# Altium project ESP32 with c port.PrjPcb
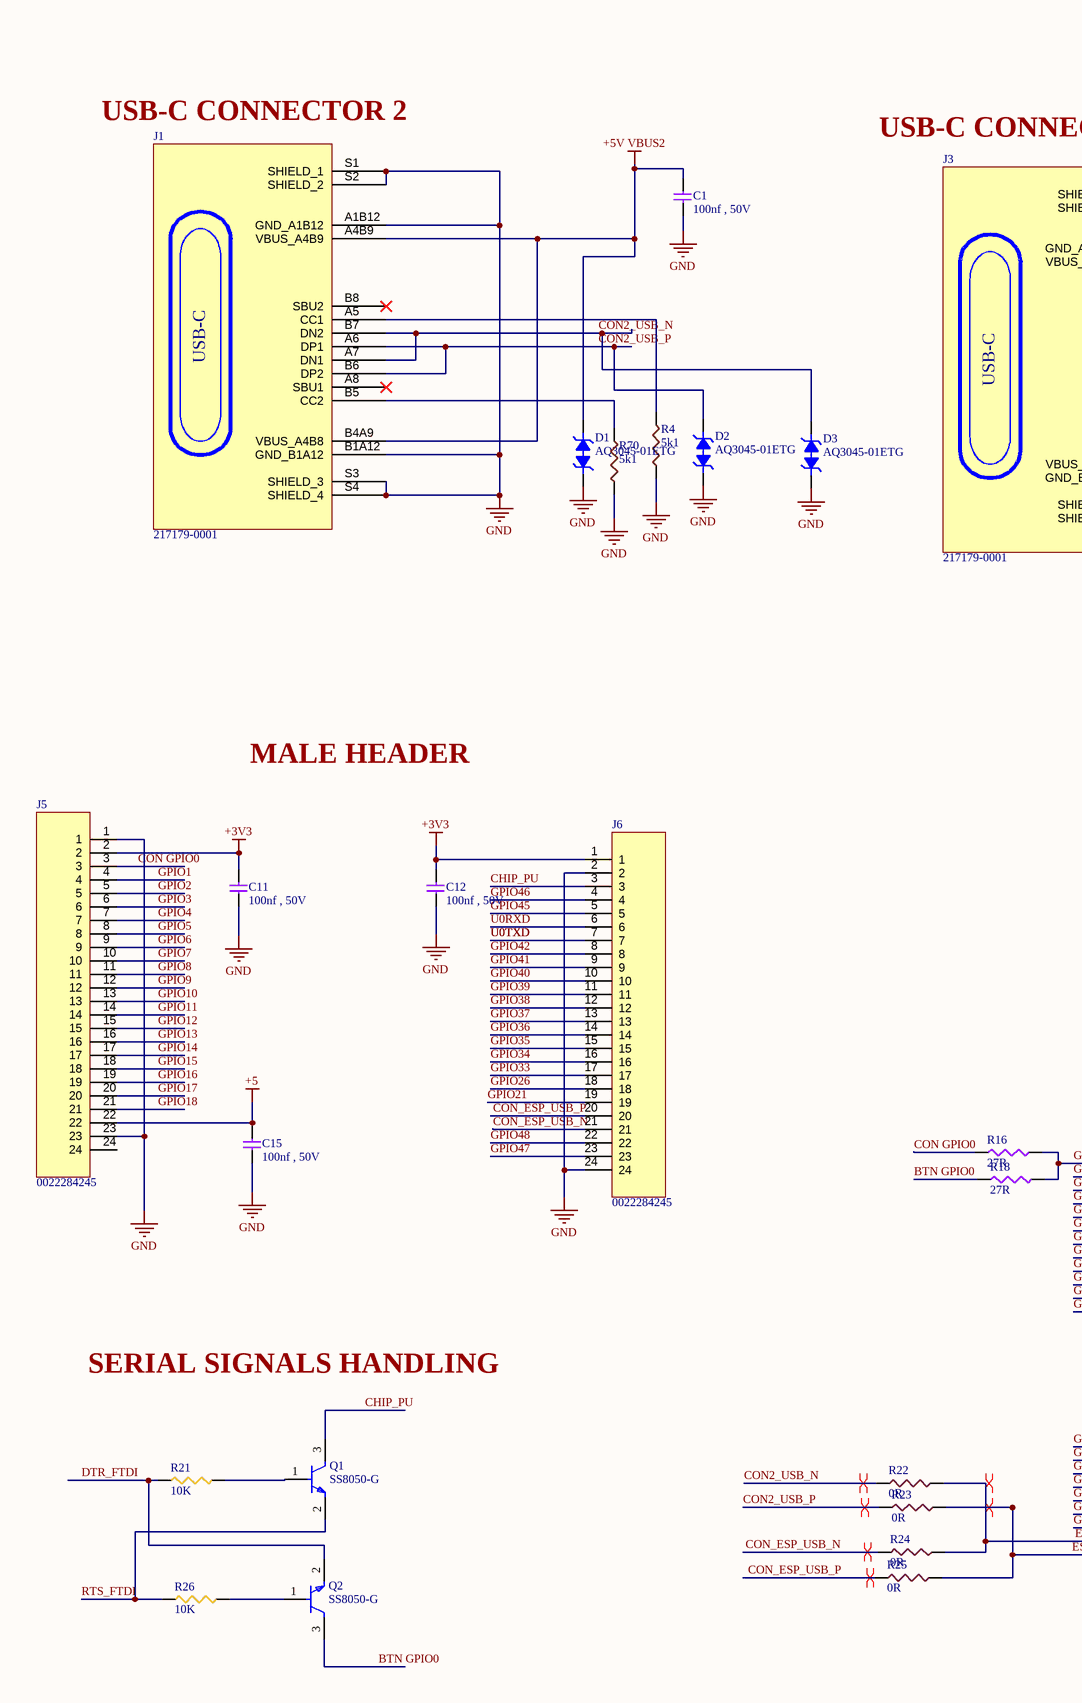
[diagram p0: Sheet1.SchDoc, left]
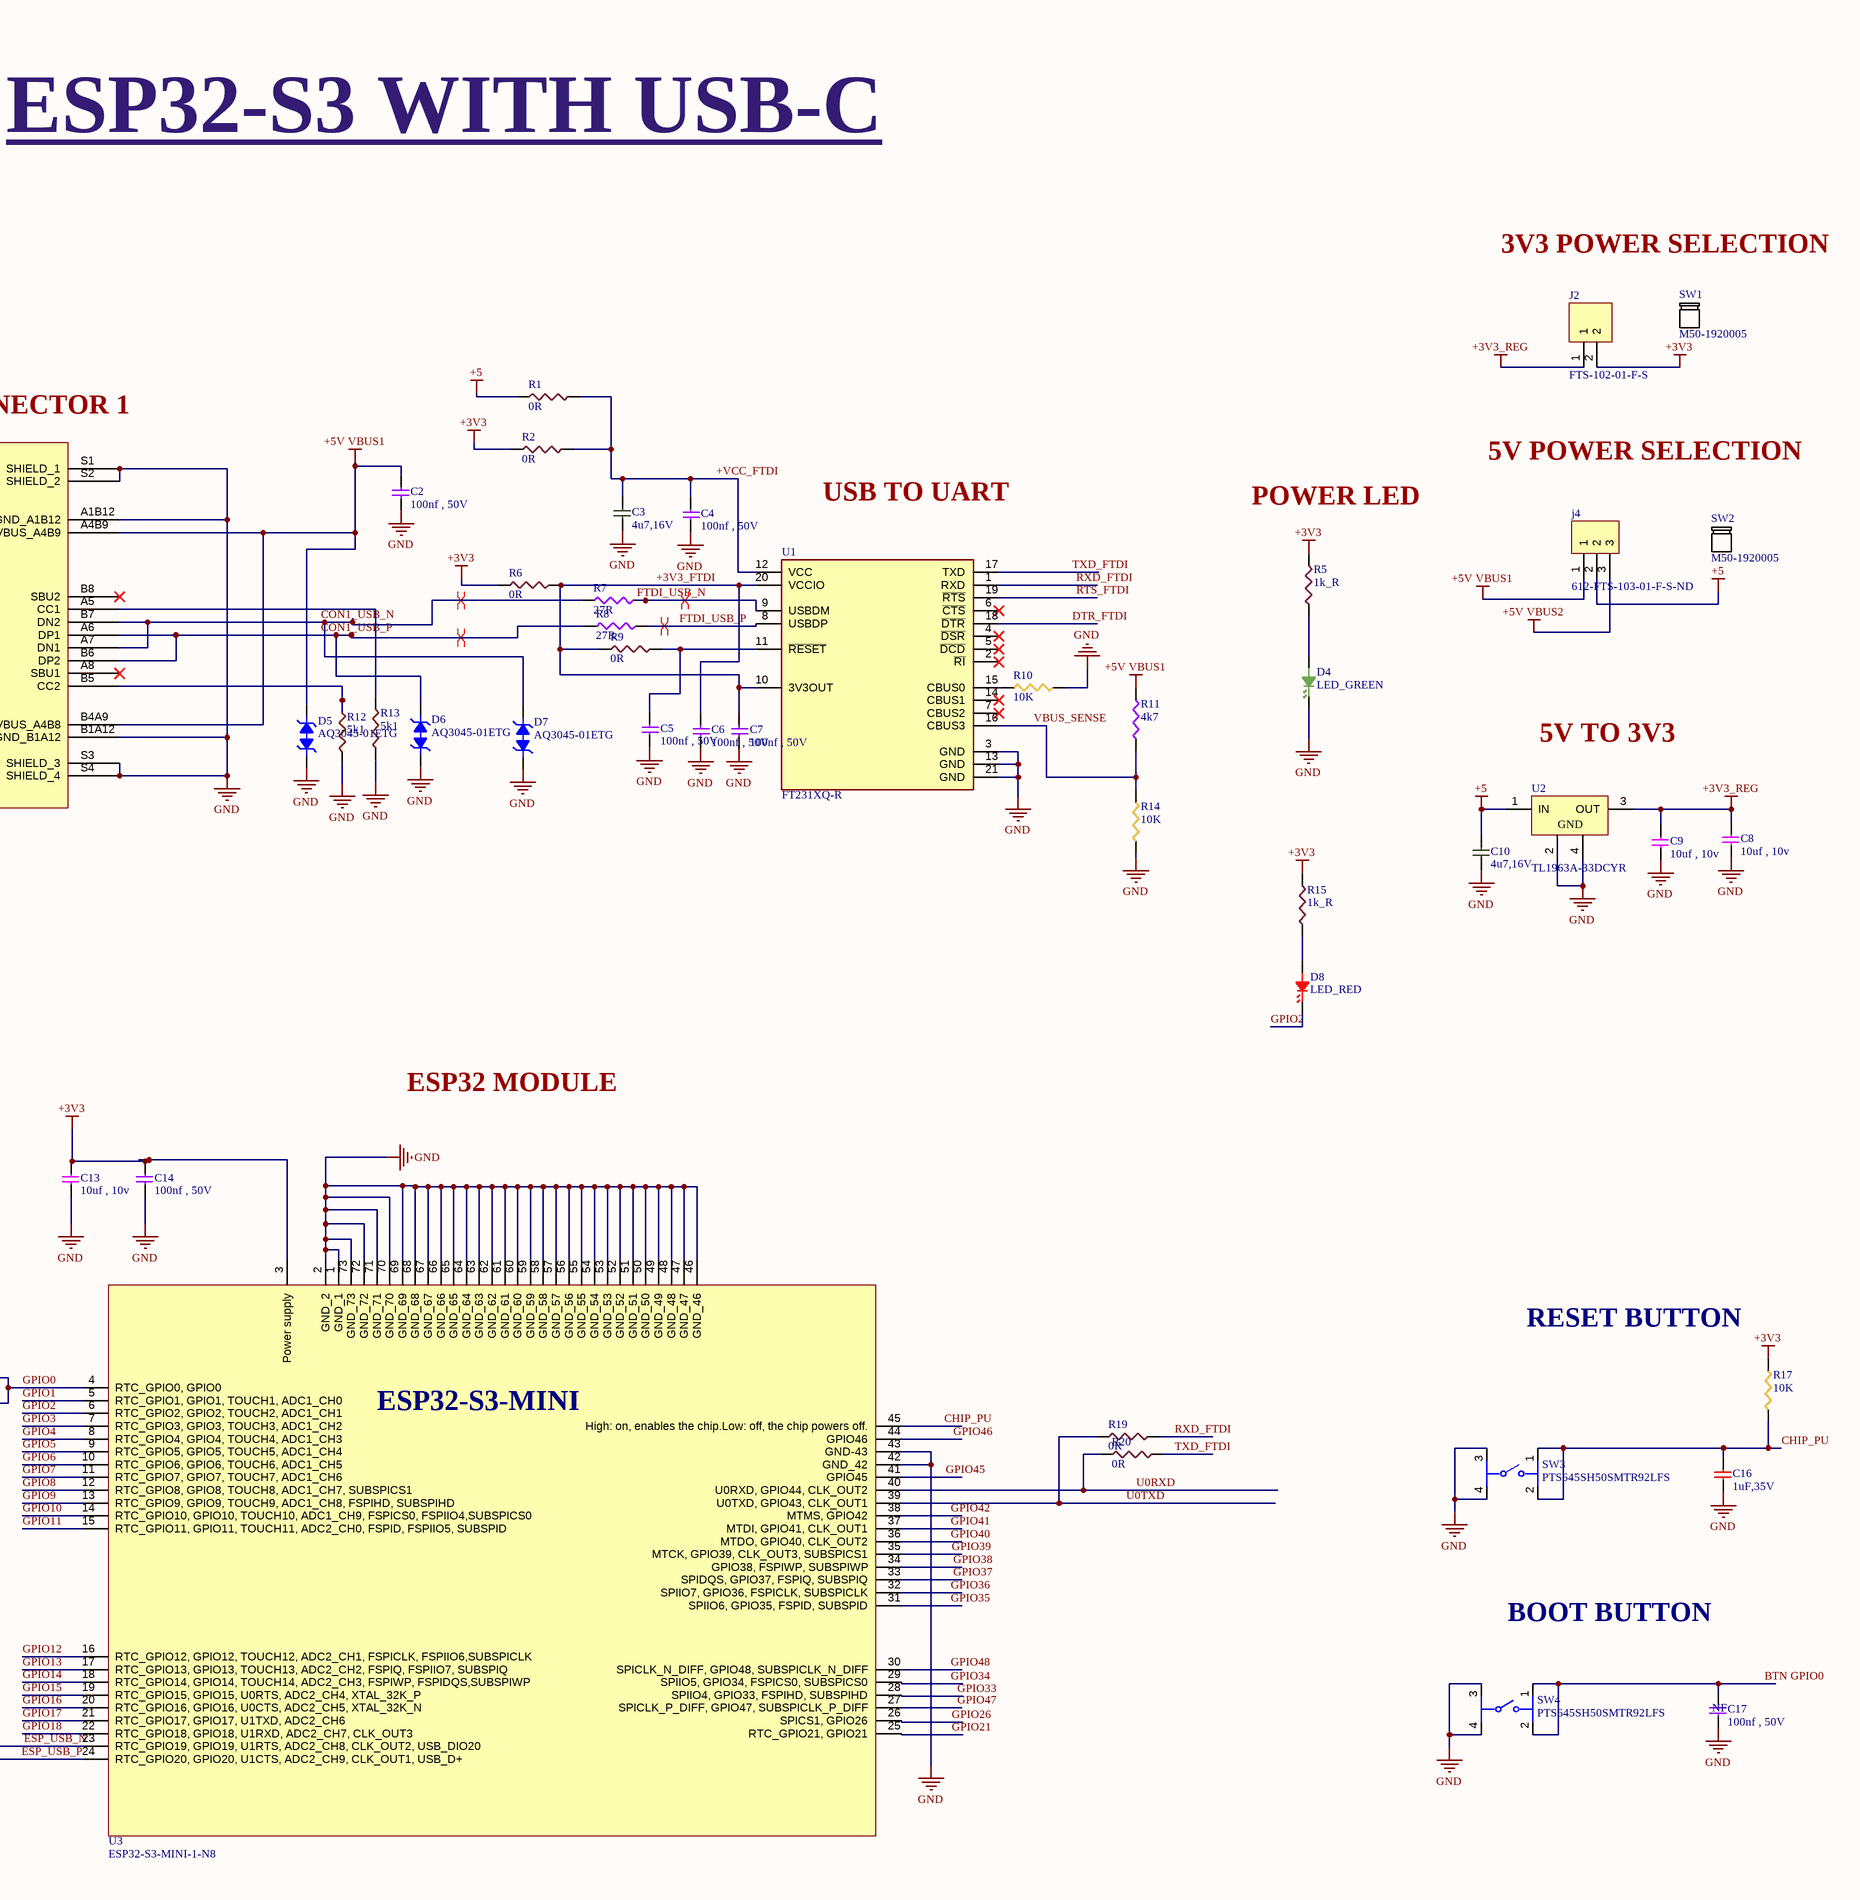
[diagram p1: Sheet1.SchDoc, right]
1 sheet, 66 parts. Net scope: global (net labels, ports and power ports of the same name join across sheets).
Board file: PCB1.PcbDoc

## Sheet Sheet1.SchDoc: ESP32 with USBC
size 594 x 420 mm; DrawnBy: Shubham Gupta; Engineer: Shubham Gupta; SheetNumber: 1; SheetTotal: 1

### Parts
C1  100nf , 50V  [CAPC1005X55N]
C2  100nf , 50V  [CAPC1005X55N]
C3  4u7,16V  [CAPC1005X55N]
C4  100nf , 50V  [CAPC1005X55N]
C5  100nf , 50V  [CAPC1005X55N]
C6  100nf , 50V  [CAPC1005X55N]
C7  100nf , 50V  [CAPC1005X55N]
C8  10uf , 10v  [CAPC1005X55N]
C9  10uf , 10v  [CAPC1005X55N]
C10  4u7,16V  [CAPC1005X55N]
C11  100nf , 50V  [CAPC1005X55N]
C12  100nf , 50V  [CAPC1005X55N]
C13  10uf , 10v  [CAPC1005X55N]
C14  100nf , 50V  [CAPC1005X55N]
C15  100nf , 50V  [CAPC1005X55N]
C16  1uF,35V  [CAPC1005X55N]
C17  100nf , 50V  [CAPC1005X55N]
D1  AQ3045-01ETG  [AQ3045-01ETG]
D2  AQ3045-01ETG  [AQ3045-01ETG]
D3  AQ3045-01ETG  [AQ3045-01ETG]
D4  LED_GREEN  [LED_0402_GRN - duplicate]
D5  AQ3045-01ETG  [AQ3045-01ETG]
D6  AQ3045-01ETG  [AQ3045-01ETG]
D7  AQ3045-01ETG  [AQ3045-01ETG]
D8  LED_RED  [LED_0402_RED]
J1  217179-0001  [FP-2171790001-MFG]
J2  FTS-102-01-F-S  [HDR_1X2]
J3  217179-0001  [FP-2171790001-MFG]
j4  612-FTS-103-01-F-S-ND  [HDR_1X3 - duplicate]
J5  0022284245  [HDR_1X24_2.54mm]
J6  0022284245  [HDR_1X24_2.54mm]
Q1  SS8050-G  [PCBComponent_1]
Q2  SS8050-G  [PCBComponent_1]
R1  0R  [RESC1005X37N]
R2  0R  [RESC1005X37N]
R4  5k1  [RESC1005X37N]
R5  1k_R  [RESC1005X37N]
R6  0R  [RESC1005X37N]
R7  27R  [RESC1005X37N]
R8  27R  [RESC1005X37N]
R9  0R  [RESC1005X37N]
R10  10K  [RESC1005X37N]
R11  4k7  [RESC1005X37N]
R12  5k1  [RESC1005X37N]
R13  5k1  [RESC1005X37N]
R14  10K  [RESC1005X37N]
R15  1k_R  [RESC1005X37N]
R16  27R  [RESC1005X37N]
R17  10K  [RESC1005X37N]
R18  27R  [RESC1005X37N]
R19  0R  [RESC1005X37N]
R20  0R  [RESC1005X37N]
R21  10K  [RESC1005X37N]
R22  0R  [RESC1005X37N]
R23  0R  [RESC1005X37N]
R24  0R  [RESC1005X37N]
R25  0R  [RESC1005X37N]
R26  10K  [RESC1005X37N]
R70  5k1  [RESC1005X37N]
SW1  M50-1920005  (mechanical)
SW2  M50-1920005  (mechanical)
SW3  PTS645SH50SMTR92LFS  [FP-PTS645SH50SMTR92LFS-MFG]
SW4  PTS645SH50SMTR92LFS  [FP-PTS645SH50SMTR92LFS-MFG]
U1  FT231XQ-R  [FP-QFN-20-IPC_B]
U2  TL1963A-33DCYR  [DCY0004A_N]
U3  ESP32-S3-MINI-1-N8  [XCVR_ESP32-S3-MINI-1-N8]

### Nets
+3V3: C11.2 C12.2 C13.2 C14.2 J2.2 J5.2 J6.1 R2.1 R5.2 R6.1 R15.2 R17.2 U3.3(Power_supply)
+3V3_REG: C8.2 C9.2 J2.1 U2.3(OUT)
+5: C10.2 C15.2 j4.2 J5.22 R1.1 U2.1(IN)
+5V VBUS1: C2.2 D5.2 J3.A4B9(VBUS_A4B9) J3.B4A9(VBUS_A4B8) j4.1 R11.2
+5V VBUS2: C1.2 D1.2 J1.A4B9(VBUS_A4B9) J1.B4A9(VBUS_A4B8) j4.3
GND: C1.1 C2.1 C3.1 C4.2 C5.2 C6.2 C7.2 C8.1 C9.1 C10.1 C11.1 C12.1 C13.1 C14.1 C15.1 C16.1 C17.1 D1.1 D2.1 D3.1 D4.1 D5.1 D6.1 D7.1 J1.A1B12(GND_A1B12) J1.B1A12(GND_B1A12) J1.S1(SHIELD_1) J1.S2(SHIELD_2) J1.S3(SHIELD_3) J1.S4(SHIELD_4) J3.A1B12(GND_A1B12) J3.B1A12(GND_B1A12) J3.S1(SHIELD_1) J3.S2(SHIELD_2) J3.S3(SHIELD_3) J3.S4(SHIELD_4) J5.1 J5.23 J6.2 J6.24 R4.1 R10.1 R12.1 R13.1 R14.1 R70.1 SW3.3 SW3.4 SW4.3 SW4.4 U1.3(GND) U1.13(GND) U1.21(GND) U2.2(GND) U2.4(GND) U3.1(GND_1) U3.2(GND_2) U3.42(GND_42) U3.43(GND-43) U3.46(GND_46) U3.47(GND_47) U3.48(GND_48) U3.49(GND_49) U3.50(GND_50) U3.51(GND_51) U3.52(GND_52) U3.53(GND_53) U3.54(GND_54) U3.55(GND_55) U3.56(GND_56) U3.57(GND_57) U3.58(GND_58) U3.59(GND_59) U3.60(GND_60) U3.61(GND_61) U3.62(GND_62) U3.63(GND_63) U3.64(GND_64) U3.65(GND_65) U3.66(GND_66) U3.67(GND_67) U3.68(GND_68) U3.69(GND_69) U3.70(GND_70) U3.71(GND_71) U3.72(GND_72) U3.73(GND_73)
+3V3_FTDI: C6.1 C7.1 R6.2 R9.1 U1.10(3V3OUT) U1.20(VCCIO)
+VCC_FTDI: C3.2 C4.1 R1.2 R2.2 U1.12(VCC)
BTN GPIO0: C17.2 Q2.3(C) R18.1 SW4.1 SW4.2
CHIP_PU: C16.2 J6.3 Q1.3(C) R17.1 SW3.1 SW3.2 U3.45(High:_on,_enables_the_chip.Low:_off,_the_chip_powers_off.)
CON1_USB_N: D7.2 J3.A7(DN1) J3.B7(DN2) R7.1
CON1_USB_P: D6.2 J3.A6(DP1) J3.B6(DP2) R8.1
CON2_USB_N: D3.2 J1.A7(DN1) J1.B7(DN2) R22.1
CON2_USB_P: D2.2 J1.A6(DP1) J1.B6(DP2) R23.1
CON GPIO0: J5.3 R16.1
CON_ESP_USB_N: J6.21 R24.1
CON_ESP_USB_P: J6.20 R25.1
DTR_FTDI: Q2.2(E) R21.2 U1.18(~{DTR})
ESP_USB_N: R22.2 R24.2 U3.23(RTC_GPIO19,_GPIO19,_U1RTS,_ADC2_CH8,_CLK_OUT2,_USB_DIO20)
ESP_USB_P: R23.2 R25.2 U3.24(RTC_GPIO20,_GPIO20,_U1CTS,_ADC2_CH9,_CLK_OUT1,_USB_D+)
FTDI_USB_N: R7.2 U1.9(USBDM)
FTDI_USB_P: R8.2 U1.8(USBDP)
GPIO0: R16.2 R18.2 U3.4(RTC_GPIO0,_GPIO0)
GPIO1: J5.4 U3.5(RTC_GPIO1,_GPIO1,_TOUCH1,_ADC1_CH0)
GPIO2: D8.1 J5.5 U3.6(RTC_GPIO2,_GPIO2,_TOUCH2,_ADC1_CH1)
GPIO3: J5.6 U3.7(RTC_GPIO3,_GPIO3,_TOUCH3,_ADC1_CH2)
GPIO4: J5.7 U3.8(RTC_GPIO4,_GPIO4,_TOUCH4,_ADC1_CH3)
GPIO5: J5.8 U3.9(RTC_GPIO5,_GPIO5,_TOUCH5,_ADC1_CH4)
GPIO6: J5.9 U3.10(RTC_GPIO6,_GPIO6,_TOUCH6,_ADC1_CH5)
GPIO7: J5.10 U3.11(RTC_GPIO7,_GPIO7,_TOUCH7,_ADC1_CH6)
GPIO8: J5.11 U3.12(RTC_GPIO8,_GPIO8,_TOUCH8,_ADC1_CH7,_SUBSPICS1)
GPIO9: J5.12 U3.13(RTC_GPIO9,_GPIO9,_TOUCH9,_ADC1_CH8,_FSPIHD,_SUBSPIHD)
GPIO10: J5.13 U3.14(RTC_GPIO10,_GPIO10,_TOUCH10,_ADC1_CH9,_FSPICS0,_FSPIIO4,SUBSPICS0)
GPIO11: J5.14 U3.15(RTC_GPIO11,_GPIO11,_TOUCH11,_ADC2_CH0,_FSPID,_FSPIIO5,_SUBSPID)
GPIO12: J5.15 U3.16(RTC_GPIO12,_GPIO12,_TOUCH12,_ADC2_CH1,_FSPICLK,_FSPIIO6,SUBSPICLK)
GPIO13: J5.16 U3.17(RTC_GPIO13,_GPIO13,_TOUCH13,_ADC2_CH2,_FSPIQ,_FSPIIO7,_SUBSPIQ)
GPIO14: J5.17 U3.18(RTC_GPIO14,_GPIO14,_TOUCH14,_ADC2_CH3,_FSPIWP,_FSPIDQS,SUBSPIWP)
GPIO15: J5.18 U3.19(RTC_GPIO15,_GPIO15,_U0RTS,_ADC2_CH4,_XTAL_32K_P)
GPIO16: J5.19 U3.20(RTC_GPIO16,_GPIO16,_U0CTS,_ADC2_CH5,_XTAL_32K_N)
GPIO17: J5.20 U3.21(RTC_GPIO17,_GPIO17,_U1TXD,_ADC2_CH6)
GPIO18: J5.21 U3.22(RTC_GPIO18,_GPIO18,_U1RXD,_ADC2_CH7,_CLK_OUT3)
GPIO21: J6.19 U3.25(RTC_GPIO21,_GPIO21)
GPIO26: J6.18 U3.26(SPICS1,_GPIO26)
GPIO33: J6.17 U3.28(SPIIO4,_GPIO33,_FSPIHD,_SUBSPIHD)
GPIO34: J6.16 U3.29(SPIIO5,_GPIO34,_FSPICS0,_SUBSPICS0)
GPIO35: J6.15 U3.31(SPIIO6,_GPIO35,_FSPID,_SUBSPID)
GPIO36: J6.14 U3.32(SPIIO7,_GPIO36,_FSPICLK,_SUBSPICLK)
GPIO37: J6.13 U3.33(SPIDQS,_GPIO37,_FSPIQ,_SUBSPIQ)
GPIO38: J6.12 U3.34(GPIO38,_FSPIWP,_SUBSPIWP)
GPIO39: J6.11 U3.35(MTCK,_GPIO39,_CLK_OUT3,_SUBSPICS1)
GPIO40: J6.10 U3.36(MTDO,_GPIO40,_CLK_OUT2)
GPIO41: J6.9 U3.37(MTDI,_GPIO41,_CLK_OUT1)
GPIO42: J6.8 U3.38(MTMS,_GPIO42)
GPIO45: J6.5 U3.41(GPIO45)
GPIO46: J6.4 U3.44(GPIO46)
GPIO47: J6.23 U3.27(SPICLK_P_DIFF,_GPIO47,_SUBSPICLK_P_DIFF)
GPIO48: J6.22 U3.30(SPICLK_N_DIFF,_GPIO48,_SUBSPICLK_N_DIFF)
RTS_FTDI: Q1.2(E) R26.2 U1.19(~{RTS})
RXD_FTDI: R19.1 U1.1(RXD)
TXD_FTDI: R20.2 U1.17(TXD)
U0RXD: J6.6 R20.1 U3.40(U0RXD,_GPIO44,_CLK_OUT2)
U0TXD: J6.7 R19.2 U3.39(U0TXD,_GPIO43,_CLK_OUT1)
VBUS_SENSE: R11.1 R14.2 U1.16(CBUS3)
NetC5_1: C5.1 R9.2 U1.11(~{RESET})
NetD4_2: D4.2 R5.1
NetD8_2: D8.2 R15.1
NetJ1_A5: J1.A5(CC1) R4.2
NetJ1_B5: J1.B5(CC2) R70.2
NetJ3_A5: J3.A5(CC1) R13.2
NetJ3_B5: J3.B5(CC2) R12.2
NetQ1_1: Q1.1(B) R21.1
NetQ2_1: Q2.1(B) R26.1
NetR10_2: R10.2 U1.15(CBUS0)

Not connected (* = marked no-connect by the designer): J1 A8(SBU1)* B8(SBU2)*; J3 A8(SBU1)* B8(SBU2)*; J5 24; U1 2(~{RI})* 4(~{DSR})* 5(~{DCD})* 6(~{CTS})* 7(CBUS2)* 14(CBUS1)*

### Layout directives
differential pair: CON1_USB_N, CON1_USB_P, CON2_USB_N, CON2_USB_P, CON_ESP_USB_N, CON_ESP_USB_P, ESP_USB_N, ESP_USB_P, FTDI_USB_N, FTDI_USB_P

### Notes on the sheet
- ESP32-S3 WITH USB-C
- (near SW1) 3V3 POWER SELECTION
- (near J1) USB-C CONNECTOR 2
- (near J3) USB-C CONNECTOR 1
- USB TO UART
- POWER LED
- 5V POWER SELECTION
- 5V TO 3V3
- MALE HEADER
- ESP32 MODULE
- RESET BUTTON
- SERIAL SIGNALS HANDLING
- BOOT BUTTON
- (near C17) NF
- DWG NO:
- REV:
- THIS DOCUMENT AND THE DATA DISCLOSED HEREIN OR
- HEREWITH IS THE PROPERTY OF ALTIUM LIMITED AND MAY
- BE FREELY DISTRIBUTED IN WHOLE. NO RIGHTS ARE
- RESERVED OR EXPRESS OR IMPLIED WARANTEE GIVEN.
- REVISION
- DESCRIPTION
- DATE
- APPROVED
- ENG:
- APPROVALS
- PROJECT
- DSN:
- CHK:
- REFERENCE DOCUMENTS
- PROJECT REVISION:
- TITLE
- DOCUMENT REVISION:
- DESIGN ITEM:
- BOM:
- FAB DWG:
- PCB DWG:
- ASSY DWG:
- SCALE:
- A2
- SIZE
- CAGE CODE
- FILE NAME
- DWG NO.
- SHEET
- OF
- REV
- (in symbol 217179-0001) USB-C
- (in symbol ESP32-S3-MINI-1-N8) ESP32-S3-MINI

### Library data of the parts
C1 C2 C4-C7 C11 C12 C14 C15 C17 = CL05B104KB5NNNC: Ceramic Capacitor, Multilayer, Ceramic, 50V, 10% +Tol, 10% -Tol, X7R, 15% TC, 0.1uF, Surface Mount, 0402; Manufacturer: Samsung; Material: 4241ConductorMaterial; Dielectric: 1511DielectricType; Supplier: Digikey; Supplier Part Number: 1276-CL05B104KB5NNNCCT-ND; Manufacturer Part Number: CL05B104KB5NNNC; RoHS: Yes; Category: Ceramic Capacitors; Stock: 215757; Pricing: 1=0.08, 10=0.021, 50=0.0176, 100=0.0144, 500=0.0128, 1000=0.0112, 2500=0.0096 (USD); Case/Package: 343Case; Min Operating Temperature: -55°C; Max Operating Temperature: 125°C; Value: 100nF; Tolerance: 10%; Voltage Rating: 50V; Voltage Rating (DC): 50V; Height: 550um; RoHS Compliant: Yes; ComponentLink1URL: https://datasheet.octopart.com/CL05B104KB5NNNC-Samsung-datasheet-97040617.pdf?src-supplier=Future+Electronics; ComponentLink1Description: https://datasheet.octopart.com/CL05B104KB5NNNC-Samsung-datasheet-97040617.pdf?src-supplier=Future+Electronics; ComponentLink2URL: https://datasheet.octopart.com/CL05B104KB5NNNC-Samsung-datasheet-8326407.pdf?src-supplier=TME; ComponentLink2Description: https://datasheet.octopart.com/CL05B104KB5NNNC-Samsung-datasheet-8326407.pdf?src-supplier=TME
C3 C10 = CL05A475MO5NUNC: Multilayer Ceramic Capacitor, 4.7 uF, 16 V, ± 20%, X5R, 0402 [1005 Metric]; Manufacturer: Samsung; Material: 4241ConductorMaterial; Value: 4.7uF; Supplier: Digikey; Supplier Part Number: 1276-6836-1-ND; Manufacturer Part Number: CL05A475MO5NUNC; RoHS: Yes; Category: Ceramic Capacitors; Stock: 110716; Pricing: 1=0.32, 10=0.156, 50=0.1316, 100=0.1072, 500=0.1, 1000=0.0928, 2500=0.0808, 10000=0.07123 (USD); Mounting Technology: Surface Mount; Case/Package: 0402; Case Code (Metric): 1005; Case Code (Imperial): 0402; Min Operating Temperature: -55°C; Max Operating Temperature: 85°C; Packaging: Cut Tape; Voltage Rating: 16V; Tolerance: 20%; Series: CL; Voltage Rating (DC): 16V; Length: 0.039inch; Width: 0.02inch; Height: 550um; Thickness: 0.022inch; RoHS Compliant: Yes; ComponentLink1URL: http://www.farnell.com/datasheets/2710653.pdf?src-supplier=Farnell; ComponentLink1Description: http://www.farnell.com/datasheets/2710653.pdf?src-supplier=Farnell; ComponentLink2URL: http://www.samsungsem.com/kr/support/product-search/mlcc/CL05A475MO5NUNC.jsp?src-supplier=Digikey; ComponentLink2Description: http://www.samsungsem.com/kr/support/product-search/mlcc/CL05A475MO5NUNC.jsp?src-supplier=Digikey; ComponentLink3URL: http://www.farnell.com/datasheets/2710653.pdf?src-supplier=Element14; ComponentLink3Description: http://www.farnell.com/datasheets/2710653.pdf?src-supplier=Element14; ComponentLink4URL: https://datasheet.octopart.com/CL05A475MO5NUNC-Samsung-Electro-Mechanics-datasheet-123102911.pdf?src-supplier=Future+Electronics; ComponentLink4Description: https://datasheet.octopart.com/CL05A475MO5NUNC-Samsung-Electro-Mechanics-datasheet-123102911.pdf?src-supplier=Future+Electronics; ComponentLink5URL: http://www.farnell.com/datasheets/2710653.pdf?src-supplier=Newark; ComponentLink5Description: http://www.farnell.com/datasheets/2710653.pdf?src-supplier=Newark
C8 C9 C13 = CL05A106MP8NUB8: Multilayer Ceramic Capacitor, 10 uF, 10 V, ± 20%, X5R, 0402 [1005 Metric]; Manufacturer: Samsung; Material: 4241ConductorMaterial; Supplier: Digikey; Supplier Part Number: 1276-6830-1-ND; Manufacturer Part Number: CL05A106MP8NUB8; RoHS: Yes; Category: Ceramic Capacitors; Stock: 450449; Pricing: 1=0.26, 10=0.127, 50=0.1044, 100=0.0816, 500=0.0752, 1000=0.0688, 2500=0.0584 (USD); Mounting Technology: Surface Mount; Case/Package: 0402; Case Code (Metric): 1005; Case Code (Imperial): 0402; Min Operating Temperature: -55°C; Max Operating Temperature: 85°C; Packaging: Cut Tape; Value: 10uF; Voltage Rating: 10V; Tolerance: 20%; Series: CL; Length: 0.039inch; Width: 0.02inch; Height: 550um; Thickness: 0.035inch; RoHS Compliant: Yes; ComponentLink1URL: http://www.samsungsem.com/kr/support/product-search/mlcc/CL05A106MP8NUB8.jsp?src-supplier=Digikey; ComponentLink1Description: http://www.samsungsem.com/kr/support/product-search/mlcc/CL05A106MP8NUB8.jsp?src-supplier=Digikey; ComponentLink2URL: https://datasheet.octopart.com/CL05A106MP8NUB8-Samsung-Electro-Mechanics-datasheet-136460857.pdf?src-supplier=Future+Electronics; ComponentLink2Description: https://datasheet.octopart.com/CL05A106MP8NUB8-Samsung-Electro-Mechanics-datasheet-136460857.pdf?src-supplier=Future+Electronics
C16 = CL05A105KL5NRNC: Ceramic Capacitor, Multilayer, Ceramic, 35V, 10% +Tol, 10% -Tol, X5R, 15% TC, 1uF, Surface Mount, 0402; Manufacturer: Samsung; Material: 4241ConductorMaterial; Supplier: Digikey; Supplier Part Number: 1276-6796-1-ND; Manufacturer Part Number: CL05A105KL5NRNC; RoHS: Yes; Category: Ceramic Capacitors; Stock: 279594; Pricing: 1=0.31, 10=0.181, 50=0.1296, 100=0.1136, 500=0.08658, 1000=0.07816, 2500=0.06921, 5000=0.06379 (USD); Mounting Technology: Surface Mount; Case/Package: 0402; Case Code (Metric): 1005; Case Code (Imperial): 0402; Min Operating Temperature: -55°C; Max Operating Temperature: 85°C; Packaging: Cut Tape; Value: 1uF; Voltage Rating: 35V; Tolerance: 10%; Series: CL; Length: 0.039inch; Width: 0.02inch; Height: 550um; Thickness: 0.022inch; RoHS Compliant: Yes; ComponentLink1URL: http://www.samsungsem.com/kr/support/product-search/mlcc/CL05A105KL5NRNC.jsp?src-supplier=Digikey; ComponentLink1Description: http://www.samsungsem.com/kr/support/product-search/mlcc/CL05A105KL5NRNC.jsp?src-supplier=Digikey
D1-D3 D5-D7 = AQ3045-01ETG: TVS DIODE 12VC 3A SOD882 / ESD Suppressor TVS Bi-Dir 5.3V Automotive 2-Pin SOD-882 T/R; Manufacturer: Littelfuse; Number of Bidirectional Channels: 1; Min Breakdown Voltage: 6.8V; Peak Pulse Power: 40W; Power Line Protection: No; Diode Type: ZENER; Leakage Current: 100nA; Number of Channels: 1NUMBER; Supplier: Digikey; Supplier Part Number: F9321CT-ND; Manufacturer Part Number: AQ3045-01ETG; RoHS: Yes; Category: TVS Diodes; Stock: 16770; Pricing: 1=0.48, 10=0.321, 100=0.17, 500=0.152, 1000=0.134, 2000=0.13, 5000=0.126 (USD); Mounting Technology: Surface Mount; Min Operating Temperature: -55°C; Max Operating Temperature: 150°C; Packaging: Cut Tape; Reverse Standoff Voltage: 5.3V; Peak Pulse Current: 3A; Series: Automotive, AEC-Q101, AQ3045, SPA®; Operating Supply Voltage: 5.3V; RoHS Compliant: Yes; ComponentLink1URL: https://www.littelfuse.com/~/media/electronics/datasheets/tvs_diode_arrays/littelfuse_tvs_diode_array_aq3045_datasheet.pdf.pdf?src-supplier=Digikey; ComponentLink1Description: https://www.littelfuse.com/~/media/electronics/datasheets/tvs_diode_arrays/littelfuse_tvs_diode_array_aq3045_datasheet.pdf.pdf?src-supplier=Digikey; ComponentLink2URL: http://www.littelfuse.com/~/media/electronics/datasheets/tvs_diode_arrays/littelfuse_tvs_diode_array_aq3045_datasheet.pdf.pdf?src-supplier=Digikey; ComponentLink2Description: http://www.littelfuse.com/~/media/electronics/datasheets/tvs_diode_arrays/littelfuse_tvs_diode_array_aq3045_datasheet.pdf.pdf?src-supplier=Digikey
D4 = VLMG1500-GS08: LED Uni-Color Yellow Green 574nm 2-Pin Chip 0402(1006Metric) T/R; Manufacturer: Vishay; Color: Green,Yellow; Lens Color: Clear; Viewing Angle: 130°; Forward Current: 30mA; Forward Voltage: 2V; Luminous Intensity: 35mcd; Dominant Wavelength: 571nm; Test Current: 20mA; Number of Elements: 1; Power Dissipation: 75mW; Lens Style: Rectangular; Reverse Voltage: 5V; Supplier: Digikey; Supplier Part Number: VLMG1500-GS08CT-ND; Manufacturer Part Number: VLMG1500-GS08; RoHS: Yes; Category: LEDs; Stock: 86666; Pricing: 1=0.33, 10=0.189, 100=0.1166, 500=0.08838, 1000=0.07977 (USD); Mounting Technology: Surface Mount; Case/Package: 0402; Pins: 2; Case Code (Metric): 1005; Case Code (Imperial): 0402; Min Operating Temperature: -30°C; Max Operating Temperature: 85°C; Package Quantity: 1; Packaging: Tape and Reel; Illumination Color: Green; Wavelength: 571nm; Number of LEDs: 1; Power Rating: 75mW; Series: CHipLED; Length: 1mm; Width: 0.5mm; Height: 0.35mm; Depth: 0.5mm; Radiation Hardening: No; Lead Free: Lead Free; RoHS Compliant: Yes; Reach SVHC Compliant: Unknown; ComponentLink1URL: https://datasheet.ciiva.com/12071/vlmo1500-244705-12071911.pdf?src-supplier=Mouser; ComponentLink1Description: https://datasheet.ciiva.com/12071/vlmo1500-244705-12071911.pdf?src-supplier=Mouser; ComponentLink2URL: https://datasheet.ciiva.com/30005/vlmo1500-30005134.pdf?src-supplier=Avnet; ComponentLink2Description: https://datasheet.ciiva.com/30005/vlmo1500-30005134.pdf?src-supplier=Avnet
D8 = VLMS1500-GS08: LED Uni-Color Super Red 639nm 2-Pin Chip 0402(1006Metric) T/R; Manufacturer: Vishay; Viewing Angle: 130°; Forward Current: 30mA; Forward Voltage: 2V; Luminous Intensity: 54mcd; Dominant Wavelength: 631nm; Test Current: 20mA; Lens Style: Flat,Rectangular,Square; Number of LEDs: 1; Power Rating: 75mW; Lens Size: 0.5mm; Supplier: Mouser; Supplier Part Number: 78-VLMS1500-GS08; Manufacturer Part Number: VLMS1500-GS08; RoHS: Yes; Category: LEDs; Stock: 27817; Pricing: 1=0.33, 10=0.189, 50=0.189, 100=0.089, 1000=0.077, 10000=0.058 (USD); Mounting Technology: Surface Mount; Case/Package: 0402; Pins: 2; Color: Red; Case Code (Metric): 1005; Case Code (Imperial): 0402; Min Operating Temperature: -30°C; Max Operating Temperature: 85°C; Package Quantity: 9000; Packaging: Tape and Reel; Illumination Color: Red; Wavelength: 631nm; Series: CHipLED; Length: 1mm; Width: 0.5mm; Height: 0.55mm; Radiation Hardening: No; Lead Free: Lead Free; RoHS Compliant: Yes; Reach SVHC Compliant: Unknown; ComponentLink1URL: http://components.arrow.com/part/dataview/56357384S461524N5680?src-supplier=Arrow+Electronics; ComponentLink1Description: http://components.arrow.com/part/dataview/56357384S461524N5680?src-supplier=Arrow+Electronics; ComponentLink2URL: http://www.mouser.com/ds/2/427/vlmo1500-244705.pdf?src-supplier=Mouser; ComponentLink2Description: http://www.mouser.com/ds/2/427/vlmo1500-244705.pdf?src-supplier=Mouser; ComponentLink3URL: http://www.farnell.com/datasheets/1809983.pdf?src-supplier=Farnell; ComponentLink3Description: http://www.farnell.com/datasheets/1809983.pdf?src-supplier=Farnell; ComponentLink4URL: http://www.alliedelec.com/m/d/cfc385e1097fc985ee9a50a3551ac188.pdf?src-supplier=Allied+Electronics; ComponentLink4Description: http://www.alliedelec.com/m/d/cfc385e1097fc985ee9a50a3551ac188.pdf?src-supplier=Allied+Electronics; ComponentLink5URL: https://datasheet.octopart.com/VLMS1500-GS08-Vishay-datasheet-62332426.pdf?src-supplier=Newark; ComponentLink5Description: https://datasheet.octopart.com/VLMS1500-GS08-Vishay-datasheet-62332426.pdf?src-supplier=Newark; ComponentLink6URL: http://www.vishay.com/docs/82554/vlmo1500.pdf?src-supplier=Avnet; ComponentLink6Description: http://www.vishay.com/docs/82554/vlmo1500.pdf?src-supplier=Avnet; ComponentLink7URL: https://datasheet.octopart.com/VLMS1500-GS08-Vishay-datasheet-21227148.pdf?src-supplier=Future+Electronics; ComponentLink7Description: https://datasheet.octopart.com/VLMS1500-GS08-Vishay-datasheet-21227148.pdf?src-supplier=Future+Electronics; ComponentLink8URL: http://www.farnell.com/datasheets/2050839.pdf?src-supplier=Newark; ComponentLink8Description: http://www.farnell.com/datasheets/2050839.pdf?src-supplier=Newark; ComponentLink9URL: http://www.farnell.com/datasheets/1809983.pdf?src-supplier=Element14; ComponentLink9Description: http://www.farnell.com/datasheets/1809983.pdf?src-supplier=Element14; ComponentLink10URL: https://datasheet.octopart.com/VLMS1500-GS08-Vishay-datasheet-33014519.pdf?src-supplier=Element14; ComponentLink10Description: https://datasheet.octopart.com/VLMS1500-GS08-Vishay-datasheet-33014519.pdf?src-supplier=Element14; ComponentLink11URL: http://www.farnell.com/datasheets/1809983.pdf?src-supplier=Newark; ComponentLink11Description: http://www.farnell.com/datasheets/1809983.pdf?src-supplier=Newark; ComponentLink12URL: http://datasheet.octopart.com/VLMS1500-GS08-Vishay-datasheet-21227148.pdf?src-supplier=Avnet; ComponentLink12Description: http://datasheet.octopart.com/VLMS1500-GS08-Vishay-datasheet-21227148.pdf?src-supplier=Avnet; ComponentLink13URL: http://datasheet.octopart.com/VLMS1500-GS08-Vishay-datasheet-21227148.pdf?src-supplier=LCSC; ComponentLink13Description: http://datasheet.octopart.com/VLMS1500-GS08-Vishay-datasheet-21227148.pdf?src-supplier=LCSC; ComponentLink14URL: http://datasheet.octopart.com/VLMS1500-GS08-Vishay-datasheet-21227148.pdf?src-supplier=Quest; ComponentLink14Description: http://datasheet.octopart.com/VLMS1500-GS08-Vishay-datasheet-21227148.pdf?src-supplier=Quest; ComponentLink15URL: http://datasheet.octopart.com/VLMS1500-GS08-Vishay-datasheet-21227148.pdf?src-supplier=NAC+Semi; ComponentLink15Description: http://datasheet.octopart.com/VLMS1500-GS08-Vishay-datasheet-21227148.pdf?src-supplier=NAC+Semi
J1 J3 = 217179-0001: USB Connector, 16 Contact(s), Female, Right Angle, Surface Mount Terminal, Locking, Receptacle; Manufacturer: Molex; USB Standard: USB 2.0; Current Rating: 1.25A; Number of Contacts: 16; Voltage Rating: 30V; Supplier: Avnet; Supplier Part Number: 35AJ1973; Manufacturer Part Number: 217179-0001; RoHS: No; Category: Connectors; Stock: 7200; Pricing: 1=1.02, 25=0.853, 100=0.722, 250=0.677, 500=0.631 (USD); Contact Material: Nickel,Gold; Min Operating Temperature: -40°C; Max Operating Temperature: 85°C; Gender: Receptacle; Height: 3.36mm
J2 = FTS-102-01-F-S: Conn Unshrouded Header HDR 2 POS 1.27mm Solder ST Top Entry Thru-Hole Layer; Manufacturer: Samtec; Number of Contacts: 2; Gender: Male; Supplier: Digikey; Supplier Part Number: SAM15176-ND; Manufacturer Part Number: FTS-102-01-F-S; RoHS: Yes; Category: Connectors; Stock: 552; Pricing: 1=0.49, 50=0.4252, 100=0.3608, 500=0.2994, 1000=0.25609, 2000=0.20954, 5000=0.16589, 10000=0.1625 (USD); Mounting Technology: Through Hole; Contact Plating: Gold; Contact Material: Bronze; Contact Shape: Square; Contact Finish - Mating: GOLD; Insulation Material: Polymer; Insulation Color: Black; Min Operating Temperature: -55°C; Max Operating Temperature: 125°C; Number of Rows: 1; Packaging: Bulk; Termination: Solder; Fastening Type: Pull; Series: FTS; Contact Type: Male Pin; Number of Positions: 2; Pitch: 1.27mm; Radiation Hardening: No; RoHS Compliant: Yes; Flammability Rating: UL94 V-0; ComponentLink1URL: http://www.samtec.com/documents/webfiles/pdf/FTS.pdf?src-supplier=Avnet; ComponentLink1Description: http://www.samtec.com/documents/webfiles/pdf/FTS.pdf?src-supplier=Avnet
j4 = FTS-103-01-F-S: Conn Unshrouded Header HDR 3 POS 1.27mm Solder ST Thru-Hole; Manufacturer: Samtec; Supplier: Digikey; Supplier Part Number: 612-FTS-103-01-F-S-ND; Manufacturer Part Number: FTS-103-01-F-S; RoHS: Yes; Category: Connectors; Stock: 2615; Pricing: 1=0.73, 50=0.6378, 100=0.5407, 500=0.4491, 1000=0.38362, 2000=0.31431, 5000=0.2478, 10000=0.2375 (USD); ComponentLink1URL: http://www.samtec.com/documents/webfiles/pdf/FTS.pdf?src-supplier=Avnet; ComponentLink1Description: http://www.samtec.com/documents/webfiles/pdf/FTS.pdf?src-supplier=Avnet; ComponentLink2URL: http://suddendocs.samtec.com/prints/fts-1xx-xx-xx-xx-xx-mkt.pdf?src-supplier=Digikey; ComponentLink2Description: http://suddendocs.samtec.com/prints/fts-1xx-xx-xx-xx-xx-mkt.pdf?src-supplier=Digikey; ComponentLink3URL: https://datasheet.octopart.com/FTS-103-01-F-S-Samtec-datasheet-116535195.pdf?src-supplier=Toby+Electronics; ComponentLink3Description: https://datasheet.octopart.com/FTS-103-01-F-S-Samtec-datasheet-116535195.pdf?src-supplier=Toby+Electronics; ComponentLink4URL: https://datasheet.octopart.com/FTS-103-01-F-S-Samtec-datasheet-151470456.pdf?src-supplier=Sager+Electronics; ComponentLink4Description: https://datasheet.octopart.com/FTS-103-01-F-S-Samtec-datasheet-151470456.pdf?src-supplier=Sager+Electronics
J5 J6 = 0022284245: Conn Unshrouded Header HDR 24 POS 2.54mm Solder ST Top Entry Thru-Hole KK® Bag; Manufacturer: Molex; Current Rating: 4A; Voltage Rating: 250V; Number of Positions: 24; Gender: Male; Glow Wire Compliant: Non-compliant; Supplier: Mouser; Supplier Part Number: 538-22-28-4245; Manufacturer Part Number: 0022284245; RoHS: Yes; Category: Uncategorized; Stock: 293; Pricing: 1=1.45, 10=1.1, 50=1.1, 100=0.85, 1000=0.735, 10000=0.735 (USD); Mounting Technology: Through Hole; Contact Plating: Gold; Contact Material: Brass; Color: Black; Housing Color: Black; Housing Material: Thermoplastic; Contact Shape: Square; Contact Finish - Mating: GOLD; Insulation Material: Nylon; Insulation Color: Black; Number of Rows: 1; Packaging: Bulk; Package Quantity: 1; Termination: Solder; Number of Contacts: 24; Orientation: Vertical; Number of Circuits: 24; Series: 42375; Contact Type: Male Pin; Fastening Type: Pull; Pitch: 2.54mm; Contact Mating Length: 0.295inch; Lead Free: Lead Free; RoHS Compliant: Yes; Flammability Rating: UL94 V-0; ComponentLink1URL: https://datasheet.ciiva.com/6814/022284363-sd-6814049.pdf?src-supplier=Digikey; ComponentLink1Description: https://datasheet.ciiva.com/6814/022284363-sd-6814049.pdf?src-supplier=Digikey; ComponentLink2URL: https://datasheet.ciiva.com/5153/0022284245-pcb-headers-228340-5153875.pdf?src-supplier=Mouser; ComponentLink2Description: https://datasheet.ciiva.com/5153/0022284245-pcb-headers-228340-5153875.pdf?src-supplier=Mouser; ComponentLink3URL: https://datasheet.ciiva.com/10075/0022284245-pcb-headers-10075617.pdf?src-supplier=Avnet; ComponentLink3Description: https://datasheet.ciiva.com/10075/0022284245-pcb-headers-10075617.pdf?src-supplier=Avnet; ComponentLink4URL: https://datasheet.ciiva.com/1433/1597854-1433759.pdf?src-supplier=Element14; ComponentLink4Description: https://datasheet.ciiva.com/1433/1597854-1433759.pdf?src-supplier=Element14
Q1 Q2 = SS8050-G: Trans Gp Bjt NPN 25V 1.5A 300MW 3-PIN SOT-23 T/r; Manufacturer: Comchip; Transition Frequency: 100MHz; Collector-emitter Voltage-Max: 400mV; Collector Base Voltage (VCBO): 40V; Collector Emitter Saturation Voltage: 500mV; Emitter Base Voltage (VEBO): 5V; hFE Min: 200NUMBER; Number of Elements: 1NUMBER; Supplier: Mouser; Supplier Part Number: 750-SS8050-G; Manufacturer Part Number: SS8050-G; RoHS: Yes; Category: Transistors; Stock: 50354; Pricing: 1=0.29, 10=0.178, 50=0.178, 100=0.082, 1000=0.063, 10000=0.039 (USD); Mounting Technology: Surface Mount; Case/Package: TO-236-3; Max Operating Temperature: 150°C; Packaging: Cut Tape; Max Collector Current: 1.5A; Max Power Dissipation: 300mW; Collector Emitter Breakdown Voltage: 25V; Max Breakdown Voltage: 25V; Series: -; Power Dissipation: 300mW; Height: 1.15mm; RoHS Compliant: Yes; ComponentLink1URL: http://www.comchiptech.com/admin/files/product/SS8050-G RevA181526.pdf?src-supplier=Digikey; ComponentLink1Description: http://www.comchiptech.com/admin/files/product/SS8050-G RevA181526.pdf?src-supplier=Digikey
R1 R2 R6 R9 R19 R20 R22-R25 = RC0402J000CS: RC Series 0402 0 Ohms 0.03 W Jumper Surface Mount Thick Film Chip Resistor; Manufacturer: Samsung; Temperature Coefficient: 300ppm/°C; Voltage Rating: 15V; Supplier: Avnet; Supplier Part Number: RC0402J000CS; Manufacturer Part Number: RC0402J000CS; RoHS: Yes; Category: Chip SMD Resistors; Stock: 580000; Pricing: 20000=0.003 (USD); Thickness: 130um; ComponentLink1URL: https://datasheet.ciiva.com/26127/chip-resistor-150112-1-26127887.pdf?src-supplier=Digikey; ComponentLink1Description: https://datasheet.ciiva.com/26127/chip-resistor-150112-1-26127887.pdf?src-supplier=Digikey; ComponentLink2URL: https://datasheet.ciiva.com/16396/rcseries-16396701.pdf?src-supplier=Future+Electronics; ComponentLink2Description: https://datasheet.ciiva.com/16396/rcseries-16396701.pdf?src-supplier=Future+Electronics
R4 R12 R13 R70 = AC0402FR-075K1L: SMD Chip Resistor, 5.1 kOhm, ± 1%, 63 mW, 0402 [1005 Metric], Thick Film, General Purpose; Manufacturer: Yageo; Value: 5.1kR; Power Rating: 63mW; Temperature Coefficient: 100ppm/°C; Voltage Rating: 50V; Supplier: Digikey; Supplier Part Number: YAG3503CT-ND; Manufacturer Part Number: AC0402FR-075K1L; RoHS: Yes; Category: Chip SMD Resistors; Stock: 38811; Pricing: 1=0.1, 10=0.012, 50=0.0096, 100=0.0071, 500=0.00612, 1000=0.0051, 5000=0.00408 (USD); Mounting Technology: Surface Mount; Case/Package: 0402; Case Code (Metric): 1005; Case Code (Imperial): 0402; Min Operating Temperature: -55°C; Max Operating Temperature: 155°C; Tolerance: 1%; Packaging: Cut Tape; Number of Terminations: 2; Max Power Dissipation: 63mW; Features: Moisture Resistant,Automotive AEC-Q200; Series: AC; Length: 0.039inch; Width: 0.02inch; Height: 0.015inch; RoHS Compliant: Yes; Lead Free: 5697LeadFree; ComponentLink1URL: https://datasheet.octopart.com/AC0402FR-075K1L-Yageo-datasheet-166720450.pdf?src-supplier=Future+Electronics; ComponentLink1Description: https://datasheet.octopart.com/AC0402FR-075K1L-Yageo-datasheet-166720450.pdf?src-supplier=Future+Electronics; ComponentLink2URL: http://www.yageo.com/NewPortal/yageodocoutput?fileName=/pdf/R-Chip/PYu-AC_51_RoHS_L_6.pdf&src-supplier=Digikey; ComponentLink2Description: http://www.yageo.com/NewPortal/yageodocoutput?fileName=/pdf/R-Chip/PYu-AC_51_RoHS_L_6.pdf&src-supplier=Digikey; ComponentLink3URL: http://www.yageo.com/documents/recent/PYu-AC_51_RoHS_L_2_revised.pdf?src-supplier=Future+Electronics; ComponentLink3Description: http://www.yageo.com/documents/recent/PYu-AC_51_RoHS_L_2_revised.pdf?src-supplier=Future+Electronics
R5 R15 = RCS1005F102CS: Res Thick Film 0402 1K Ohm 1% 1/16W ±100ppm/°C Molded SMD Punched Paper T/R; Manufacturer: Samsung; Value: 1kR; Max Power Dissipation: 63mW; Supplier: Digikey; Supplier Part Number: 1276-7036-1-ND; Manufacturer Part Number: RCS1005F102CS; RoHS: Yes; Category: Chip SMD Resistors; Stock: 4; Pricing: 1=0.1 (USD); Case/Package: 0402; Contact Plating: Tin; Case Code (Imperial): 0402; Case Code (Metric): 1005; Min Operating Temperature: -55°C; Max Operating Temperature: 155°C; Packaging: Cut Tape; Tolerance: 1%; Temperature Coefficient: 100ppm/°C; Features: Moisture Resistant,Anti-Sulfur; Series: RCS; Number of Terminations: 2; Thickness: 350um; RoHS Compliant: Yes; ComponentLink1URL: http://www.samsungsem.com/kr/support/product-search/chip-resistor/__icsFiles/afieldfile/2019/01/21/RCS_Spec_Sheet(1901).pdf?src-supplier=Digikey; ComponentLink1Description: http://www.samsungsem.com/kr/support/product-search/chip-resistor/__icsFiles/afieldfile/2019/01/21/RCS_Spec_Sheet(1901).pdf?src-supplier=Digikey; ComponentLink2URL: http://www.samsungsem.com/kr/support/product-search/chip-resistor/RCS1005F102CS.jsp?src-supplier=Digikey; ComponentLink2Description: http://www.samsungsem.com/kr/support/product-search/chip-resistor/RCS1005F102CS.jsp?src-supplier=Digikey; ComponentLink3URL: http://www.samsungsem.com/servlet/FileDownload?filename=productcatalog/pdf/Chip_Resistor.pdf&src-supplier=Avnet; ComponentLink3Description: http://www.samsungsem.com/servlet/FileDownload?filename=productcatalog/pdf/Chip_Resistor.pdf&src-supplier=Avnet
R7 R8 R16 R18 = RC0402FR-0727RL: SMD Chip Resistor, 27 Ohm, ï¿½ 1%, 62.5 mW, 0402 [1005 Metric], Thick Film, General Purpose; Manufacturer: Yageo; Power Rating: 62.5mW; Voltage Rating: 50V; Temperature Coefficient: 100ppm/°C; Max Power Dissipation: 63mW; Supplier: Future Electronics; Supplier Part Number: 2577120; Manufacturer Part Number: RC0402FR-0727RL; RoHS: Yes; Category: Chip SMD Resistors; Stock: 3710000; Pricing: 10000=0.0015, 100000=0.0015, 300000=0.0014, 750000=0.0014, 2000000=0.0013 (USD); Case/Package: 0402; Case Code (Imperial): 0402; Case Code (Metric): 1005; Weight: 2.3E-05oz; Min Operating Temperature: -55°C; Max Operating Temperature: 155°C; Value: 27R; Tolerance: 1%; Packaging: Tape and Reel; Resistor Type: Thick Film; Termination: SMD/SMT; Number of Terminations: 2; Features: Moisture Resistant; Series: RC; Construction: Rectangular; Technology: THICK FILM; Resistance Tolerance: 1%; Voltage Rating (AC): 50V; Length: 1mm; Width: 0.5mm; Height: 0.016inch; Depth: 0.5mm; Military Standard: Not; Lead Free: Lead Free; RoHS Compliant: Yes; Reach SVHC Compliant: Unknown; ComponentLink1URL: https://datasheet.ciiva.com/11808/0900766b80c66297-11808450.pdf?src-supplier=Rs; ComponentLink1Description: https://datasheet.ciiva.com/11808/0900766b80c66297-11808450.pdf?src-supplier=Rs; ComponentLink2URL: https://datasheet.ciiva.com/17044/pyu-rc0402-51-rohs-l-6-17044345.pdf?src-supplier=Future+Electronics; ComponentLink2Description: https://datasheet.ciiva.com/17044/pyu-rc0402-51-rohs-l-6-17044345.pdf?src-supplier=Future+Electronics; ComponentLink3URL: https://datasheet.ciiva.com/7849/1018594-7849927.pdf?src-supplier=Element14; ComponentLink3Description: https://datasheet.ciiva.com/7849/1018594-7849927.pdf?src-supplier=Element14; ComponentLink4URL: https://datasheet.ciiva.com/7849/1018594-7849926.pdf?src-supplier=Element14; ComponentLink4Description: https://datasheet.ciiva.com/7849/1018594-7849926.pdf?src-supplier=Element14
R10 R14 R17 R21 R26 = AC0402FR-0710KL: SMD Chip Resistor, 10 kOhm, ï¿½ 1%, 62.5 mW, 0402 [1005 Metric], Thick Film, General Purpose; Manufacturer: Yageo; Value: 10kR; Power Rating: 62.5mW; Voltage Rating: 50V; Temperature Coefficient: 100ppm/°C; Max Power Dissipation: 63mW; Supplier: Future Electronics; Supplier Part Number: 2025338; Manufacturer Part Number: AC0402FR-0710KL; RoHS: Yes; Category: Chip SMD Resistors; Stock: 21455000; Pricing: 10000=0.0009, 50000=0.002, 300000=0.0019, 1000000=0.0018, 3000000=0.0017 (USD); Case/Package: 0402; Case Code (Imperial): 0402; Case Code (Metric): 1005; Min Operating Temperature: -55°C; Max Operating Temperature: 155°C; Tolerance: 1%; Packaging: Tape and Reel; Termination: SMD/SMT; Number of Terminations: 2; Features: Moisture Resistant,Automotive AEC-Q200; Series: AC; Length: 0.039inch; Width: 0.02inch; Height: 0.015inch; Lead Free: Lead Free; RoHS Compliant: Yes; ComponentLink1URL: https://datasheet.ciiva.com/12656/pyu-ac-51-rohs-l-2-12656634.pdf?src-supplier=Mouser; ComponentLink1Description: https://datasheet.ciiva.com/12656/pyu-ac-51-rohs-l-2-12656634.pdf?src-supplier=Mouser
R11 = RC0402FR-074K7L: SMD Chip Resistor, 4.7 kOhm, ï¿½ 1%, 62.5 mW, 0402 [1005 Metric], Thick Film, General Purpose; Manufacturer: Yageo; Voltage Rating (DC): 50V; Power Rating: 62.5mW; Value: 4.7kR; Temperature Coefficient: 100ppm/°C; Max Power Dissipation: 63mW; Supplier: Future Electronics; Supplier Part Number: 3795218; Manufacturer Part Number: RC0402FR-074K7L; RoHS: Yes; Category: Chip SMD Resistors; Stock: 510000; Pricing: 10000=0.0004, 150000=0.0004, 400000=0.0004, 1000000=0.0004, 2500000=0.0004 (USD); Case/Package: 0402; Pins: 2; Case Code (Imperial): 0402; Case Code (Metric): 1005; Min Operating Temperature: -55°C; Max Operating Temperature: 155°C; Tolerance: 1%; Voltage Rating: 50V; Packaging: Tape and Reel; Resistor Type: Thick Film; Termination: SMD/SMT; Features: Moisture Resistant; Series: RC; Number of Terminations: 2; Resistance Tolerance: 1%; Construction: Rectangular; Voltage Rating (AC): 50V; Length: 1mm; Width: 0.5mm; Depth: 0.5mm; Reach SVHC Compliant: No; Military Standard: Not; Lead Free: Lead Free; RoHS Compliant: Yes; ComponentLink1URL: https://datasheet.ciiva.com/22661/1686128-22661342.pdf?src-supplier=Element14; ComponentLink1Description: https://datasheet.ciiva.com/22661/1686128-22661342.pdf?src-supplier=Element14; ComponentLink2URL: https://datasheet.ciiva.com/7850/1018594-7850022.pdf?src-supplier=Element14; ComponentLink2Description: https://datasheet.ciiva.com/7850/1018594-7850022.pdf?src-supplier=Element14; ComponentLink3URL: https://datasheet.ciiva.com/7850/1018594-7850023.pdf?src-supplier=Element14; ComponentLink3Description: https://datasheet.ciiva.com/7850/1018594-7850023.pdf?src-supplier=Element14; ComponentLink4URL: https://datasheet.ciiva.com/15215/getdatasheetpartid-328119-15215035.pdf?src-supplier=Verical; ComponentLink4Description: https://datasheet.ciiva.com/15215/getdatasheetpartid-328119-15215035.pdf?src-supplier=Verical
SW1 SW2 = M50-1920005: Jumper (Busbar), Jumper Socket, Pin Headers, 2, 1.27 Mm Rohs Compliant: Yes |Harwin M50-1920005; Manufacturer: Harwin; Supplier: Digikey; Supplier Part Number: 952-1727-ND; Manufacturer Part Number: M50-1920005; RoHS: Yes; Category: Headers and Wire Housings; Stock: 3192; Pricing: 1=0.33, 10=0.273, 25=0.2512, 50=0.2362, 100=0.222, 250=0.20468, 500=0.19246, 1000=0.18098, 4000=0.16005 (USD); ComponentLink1URL: https://datasheet.ciiva.com/4573/m50-19x-350826-4573042.pdf?src-supplier=Mouser; ComponentLink1Description: https://datasheet.ciiva.com/4573/m50-19x-350826-4573042.pdf?src-supplier=Mouser; ComponentLink2URL: https://datasheet.ciiva.com/767/m50-19x-767921.pdf?src-supplier=Digikey; ComponentLink2Description: https://datasheet.ciiva.com/767/m50-19x-767921.pdf?src-supplier=Digikey; ComponentLink3URL: https://datasheet.ciiva.com/1412/1836978-1412125.pdf?src-supplier=Element14; ComponentLink3Description: https://datasheet.ciiva.com/1412/1836978-1412125.pdf?src-supplier=Element14; ComponentLink4URL: https://datasheet.ciiva.com/1456/m50-19x-1456640.pdf?src-supplier=Newark; ComponentLink4Description: https://datasheet.ciiva.com/1456/m50-19x-1456640.pdf?src-supplier=Newark
SW3 SW4 = PTS645SH50SMTR92LFS: Switch Tactile N.O. SPST Round Button Gull Wing 0.05A 12VDC 100000Cycles 1.96N SMD T/R; Manufacturer: ITT C&K; Contact Current Rating: 50mA; Contact Resistance: 100mR; Number of Positions: 2NUMBER; Supplier: Digikey; Supplier Part Number: CKN9085CT-ND; Manufacturer Part Number: PTS645SH50SMTR92LFS; RoHS: Yes; Category: Tactile Switches; Stock: 32384; Pricing: 1=0.4, 10=0.325, 25=0.2992, 100=0.2639, 250=0.24264, 500=0.22758 (USD); Lead Free: 5697LeadFree; ComponentLink1URL: https://datasheet.ciiva.com/29903/getdatasheetpartid-773702-29903807.pdf?src-supplier=Verical; ComponentLink1Description: https://datasheet.ciiva.com/29903/getdatasheetpartid-773702-29903807.pdf?src-supplier=Verical; ComponentLink2URL: https://datasheet.ciiva.com/14920/pts645-14920741.pdf?src-supplier=Digikey; ComponentLink2Description: https://datasheet.ciiva.com/14920/pts645-14920741.pdf?src-supplier=Digikey; ComponentLink3URL: https://datasheet.ciiva.com/22637/1707731-22637356.pdf?src-supplier=Element14; ComponentLink3Description: https://datasheet.ciiva.com/22637/1707731-22637356.pdf?src-supplier=Element14
U1 = FT231XQ-R: USB to Full Handshake UART Interface QFN20 Reel (not offered in your region); Manufacturer: FTDI; Supplier: Digikey; Supplier Part Number: 768-1128-1-ND; Manufacturer Part Number: FT231XQ-R; RoHS: Yes; Category: Interface ICs; Stock: 54755; Pricing: 1=2.34, 25=2.27, 100=2.2, 250=2, 500=1.82002, 1000=1.7625 (USD); Height: 800um; Lead Free: 5697LeadFree; ComponentLink1URL: https://datasheet.ciiva.com/4787/ds-ft231x-13571-4787570.pdf?src-supplier=Mouser; ComponentLink1Description: https://datasheet.ciiva.com/4787/ds-ft231x-13571-4787570.pdf?src-supplier=Mouser; ComponentLink2URL: https://datasheet.ciiva.com/30475/0900766b811020d3-30475405.pdf?src-supplier=Rs; ComponentLink2Description: https://datasheet.ciiva.com/30475/0900766b811020d3-30475405.pdf?src-supplier=Rs; ComponentLink3URL: https://datasheet.ciiva.com/1787/ds-ft231x-1787312.pdf?src-supplier=Digikey; ComponentLink3Description: https://datasheet.ciiva.com/1787/ds-ft231x-1787312.pdf?src-supplier=Digikey; ComponentLink4URL: https://datasheet.ciiva.com/1787/ft-x-series-1787313.pdf?src-supplier=Digikey; ComponentLink4Description: https://datasheet.ciiva.com/1787/ft-x-series-1787313.pdf?src-supplier=Digikey; ComponentLink5URL: https://datasheet.ciiva.com/1787/ft-x-series-1787314.pdf?src-supplier=Digikey; ComponentLink5Description: https://datasheet.ciiva.com/1787/ft-x-series-1787314.pdf?src-supplier=Digikey
U2 = TL1963A-33DCYR: LDO Regulator Pos 3.3V 1.5A 4-Pin(3+Tab) SOT-223 T/R; Manufacturer: Texas Instruments; Supplier: Mouser; Supplier Part Number: 595-TL1963A-33DCYR; Manufacturer Part Number: TL1963A-33DCYR; RoHS: Yes; Category: Voltage Regulators - Linear; Stock: 11202; Pricing: 1=2.68, 10=1.89, 50=1.89, 100=1.71, 1000=1.52, 10000=1.46 (USD); Thickness: 1.6mm; Lead Free: 5697LeadFree; ComponentLink1URL: https://datasheet.ciiva.com/2046/-2046068.pdf?src-supplier=Digikey; ComponentLink1Description: https://datasheet.ciiva.com/2046/-2046068.pdf?src-supplier=Digikey
U3 = ESP32-S3-MINI-1-N8: SMD module, ESP32-S3FN8, 8 MB SPI flash, PCB antenna; Manufacturer: Espressif Systems; Supplier: Digikey; Supplier Part Number: 1965-ESP32-S3-MINI-1-N8DKR-ND; Manufacturer Part Number: ESP32-S3-MINI-1-N8; RoHS: No; Category: LDO; Stock: 10103; Pricing: 1=3.1 (USD); ComponentLink1URL: https://datasheet.octopart.com/ESP32-S3-MINI-1-N8-Espressif-Systems-datasheet-165560562.pdf?src-supplier=TME; ComponentLink1Description: https://datasheet.octopart.com/ESP32-S3-MINI-1-N8-Espressif-Systems-datasheet-165560562.pdf?src-supplier=TME; LCSC PART NUMBER: *